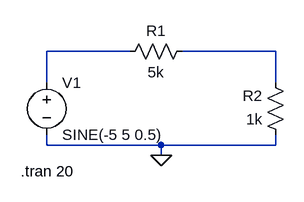
[diagram p0: schematic Draft1.asc]
Draft1.asc, the LTspice schematic file:
Version 4.1
SHEET 1 880 680
WIRE 256 64 128 64
WIRE 480 64 336 64
WIRE 128 112 128 64
WIRE 480 112 480 64
WIRE 128 208 128 192
WIRE 304 208 128 208
WIRE 480 208 480 192
WIRE 480 208 304 208
WIRE 304 224 304 208
FLAG 304 224 0
SYMBOL voltage 128 96 R0
WINDOW 123 0 0 Left 0
WINDOW 39 0 0 Left 0
SYMATTR InstName V1
SYMATTR Value SINE(-5 5 0.5)
SYMBOL res 352 48 R90
WINDOW 0 0 56 VBottom 2
WINDOW 3 32 56 VTop 2
SYMATTR InstName R1
SYMATTR Value 5k
SYMBOL res 496 208 R180
WINDOW 0 36 76 Left 2
WINDOW 3 36 40 Left 2
SYMATTR InstName R2
SYMATTR Value 1k
TEXT 88 248 Left 2 !.tran 20

The netlist it stands for:
* Draft1.asc
V1 N001 0 SINE(-5 5 0.5)
R1 N002 N001 5k
R2 0 N002 1k
.tran 20
.backanno
.end